# EAGLE schematic FPGA_S6 (EAGLE 9.6.2)

## Sheet 1 of 3: Interface
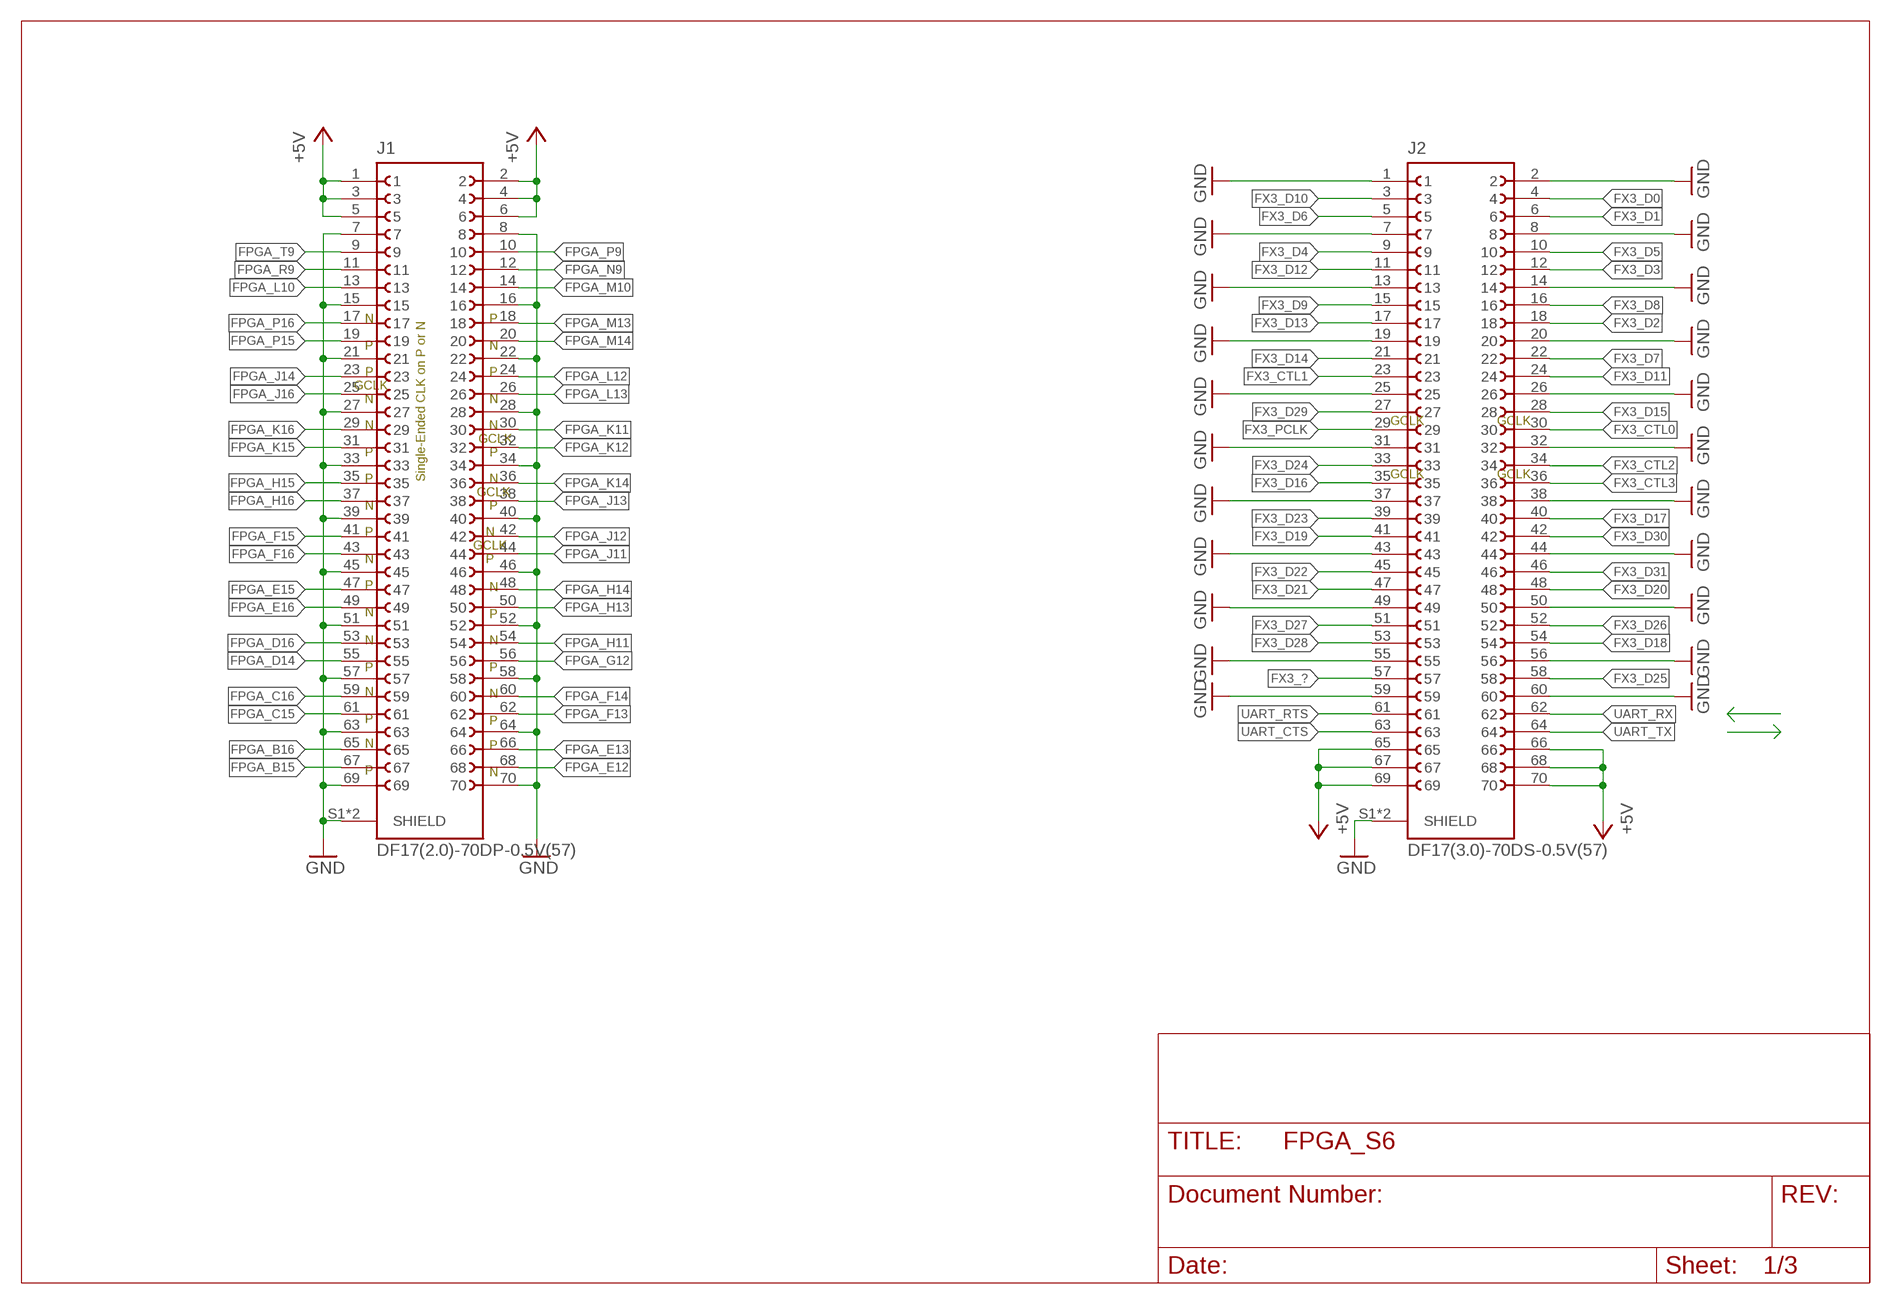
[diagram p0: schematic, sheet 1]

### Parts
J1  DF17(2.0)-70DP-0.5V(57)  [DF17(2.0)-70DP-0.5V(57)]
J2  DF17(3.0)-70DS-0.5V(57)  [DF17(3.0)-70DS-0.5V(57)]

### Nets
+5V: J1.1 J1.2 J1.3 J1.4 J1.5 J1.6 J2.65 J2.66 J2.67 J2.68 J2.69 J2.70 ; also sheet 3
FPGA_B15 [data]: J1.67 ; also sheet 2
FPGA_B16 [data]: J1.65 ; also sheet 2
FPGA_C15 [data]: J1.61 ; also sheet 2
FPGA_C16 [data]: J1.59 ; also sheet 2
FPGA_D14 [data]: J1.55 ; also sheet 2
FPGA_D16 [data]: J1.53 ; also sheet 2
FPGA_E12 [data]: J1.68 ; also sheet 2
FPGA_E13 [data]: J1.66 ; also sheet 2
FPGA_E15 [data]: J1.47 ; also sheet 2
FPGA_E16 [data]: J1.49 ; also sheet 2
FPGA_F13 [data]: J1.62 ; also sheet 2
FPGA_F14 [data]: J1.60 ; also sheet 2
FPGA_F15 [data]: J1.41 ; also sheet 2
FPGA_F16 [data]: J1.43 ; also sheet 2
FPGA_G12 [data]: J1.56 ; also sheet 2
FPGA_H11 [data]: J1.54 ; also sheet 2
FPGA_H13 [data]: J1.50 ; also sheet 2
FPGA_H14 [data]: J1.48 ; also sheet 2
FPGA_H15 [data]: J1.35 ; also sheet 2
FPGA_H16 [data]: J1.37 ; also sheet 2
FPGA_J11 [data]: J1.44 ; also sheet 2
FPGA_J12 [data]: J1.42 ; also sheet 2
FPGA_J13 [data]: J1.38 ; also sheet 2
FPGA_J14 [data]: J1.23 ; also sheet 2
FPGA_J16 [data]: J1.25 ; also sheet 2
FPGA_K11 [data]: J1.30 ; also sheet 2
FPGA_K12 [data]: J1.32 ; also sheet 2
FPGA_K14 [data]: J1.36 ; also sheet 2
FPGA_K15 [data]: J1.31 ; also sheet 2
FPGA_K16 [data]: J1.29 ; also sheet 2
FPGA_L10 [data]: J1.13 ; also sheet 2
FPGA_L12 [data]: J1.24 ; also sheet 2
FPGA_L13 [data]: J1.26 ; also sheet 2
FPGA_M10 [data]: J1.14 ; also sheet 2
FPGA_M13 [data]: J1.18 ; also sheet 2
FPGA_M14 [data]: J1.20 ; also sheet 2
FPGA_N9 [data]: J1.12 ; also sheet 2
FPGA_P9 [data]: J1.10 ; also sheet 2
FPGA_P15 [data]: J1.19 ; also sheet 2
FPGA_P16 [data]: J1.17 ; also sheet 2
FPGA_R9 [data]: J1.11 ; also sheet 2
FPGA_T9 [data]: J1.9 ; also sheet 2
FX3_? [data]: J2.57 ; also sheet 2
FX3_CTL0 [data]: J2.30 ; also sheet 2
FX3_CTL1 [data]: J2.23 ; also sheet 2
FX3_CTL2 [data]: J2.34 ; also sheet 2
FX3_CTL3 [data]: J2.36 ; also sheet 2
FX3_D0 [data]: J2.4 ; also sheet 2
FX3_D1 [data]: J2.6 ; also sheet 2
FX3_D2 [data]: J2.18 ; also sheet 2
FX3_D3 [data]: J2.12 ; also sheet 2
FX3_D4 [data]: J2.9 ; also sheet 2
FX3_D5 [data]: J2.10 ; also sheet 2
FX3_D6 [data]: J2.5 ; also sheet 2
FX3_D7 [data]: J2.22 ; also sheet 2
FX3_D8 [data]: J2.16 ; also sheet 2
FX3_D9 [data]: J2.15 ; also sheet 2
FX3_D10 [data]: J2.3 ; also sheet 2
FX3_D11 [data]: J2.24 ; also sheet 2
FX3_D12 [data]: J2.11 ; also sheet 2
FX3_D13 [data]: J2.17 ; also sheet 2
FX3_D14 [data]: J2.21 ; also sheet 2
FX3_D15 [data]: J2.28 ; also sheet 2
FX3_D16 [data]: J2.35 ; also sheet 2
FX3_D17 [data]: J2.40 ; also sheet 2
FX3_D18 [data]: J2.54 ; also sheet 2
FX3_D19 [data]: J2.41 ; also sheet 2
FX3_D20 [data]: J2.48 ; also sheet 2
FX3_D21 [data]: J2.47 ; also sheet 2
FX3_D22 [data]: J2.45 ; also sheet 2
FX3_D23 [data]: J2.39 ; also sheet 2
FX3_D24 [data]: J2.33 ; also sheet 2
FX3_D25 [data]: J2.58 ; also sheet 2
FX3_D26 [data]: J2.52 ; also sheet 2
FX3_D27 [data]: J2.51 ; also sheet 2
FX3_D28 [data]: J2.53 ; also sheet 2
FX3_D29 [data]: J2.27 ; also sheet 2
FX3_D30 [data]: J2.42 ; also sheet 2
FX3_D31 [data]: J2.46 ; also sheet 2
FX3_PCLK [data]: J2.29 ; also sheet 2
GND: J1.7 J1.8 J1.15 J1.16 J1.21 J1.22 J1.27 J1.28 J1.33 J1.34 J1.39 J1.40 J1.45 J1.46 J1.51 J1.52 J1.57 J1.58 J1.63 J1.64 J1.69 J1.70 J1.S1(SHIELD) J1.S2(SHIELD) J2.1 J2.2 J2.7 J2.8 J2.13 J2.14 J2.19 J2.20 J2.25 J2.26 J2.31 J2.32 J2.37 J2.38 J2.43 J2.44 J2.49 J2.50 J2.55 J2.56 J2.59 J2.60 J2.S1(SHIELD) J2.S2(SHIELD) ; also sheet 2,3
UART_CTS [data]: J2.63 ; also sheet 2
UART_RTS [data]: J2.61 ; also sheet 2
UART_RX [data]: J2.62 ; also sheet 2
UART_TX [data]: J2.64 ; also sheet 2

### Notes on the sheet
- N
   
  P
- P
   
  N
- P
   GCLK
  N
- P
   
  N
- Single-Ended CLK on P or N
- GCLK | GCLK
- N
   
  P
- N
   GCLK
  P
- GCLK | GCLK
- P
   
  N
- N
  GCLK
  P
- P
  
  N
- N
  GCLK
  P
- P
   
  N
- N
   
  P
- N
   
  P
- N
   
  P
- N
   
  P
- N
   
  P
- N
   
  P
- P
   
  N

## Sheet 2 of 3: FPGA
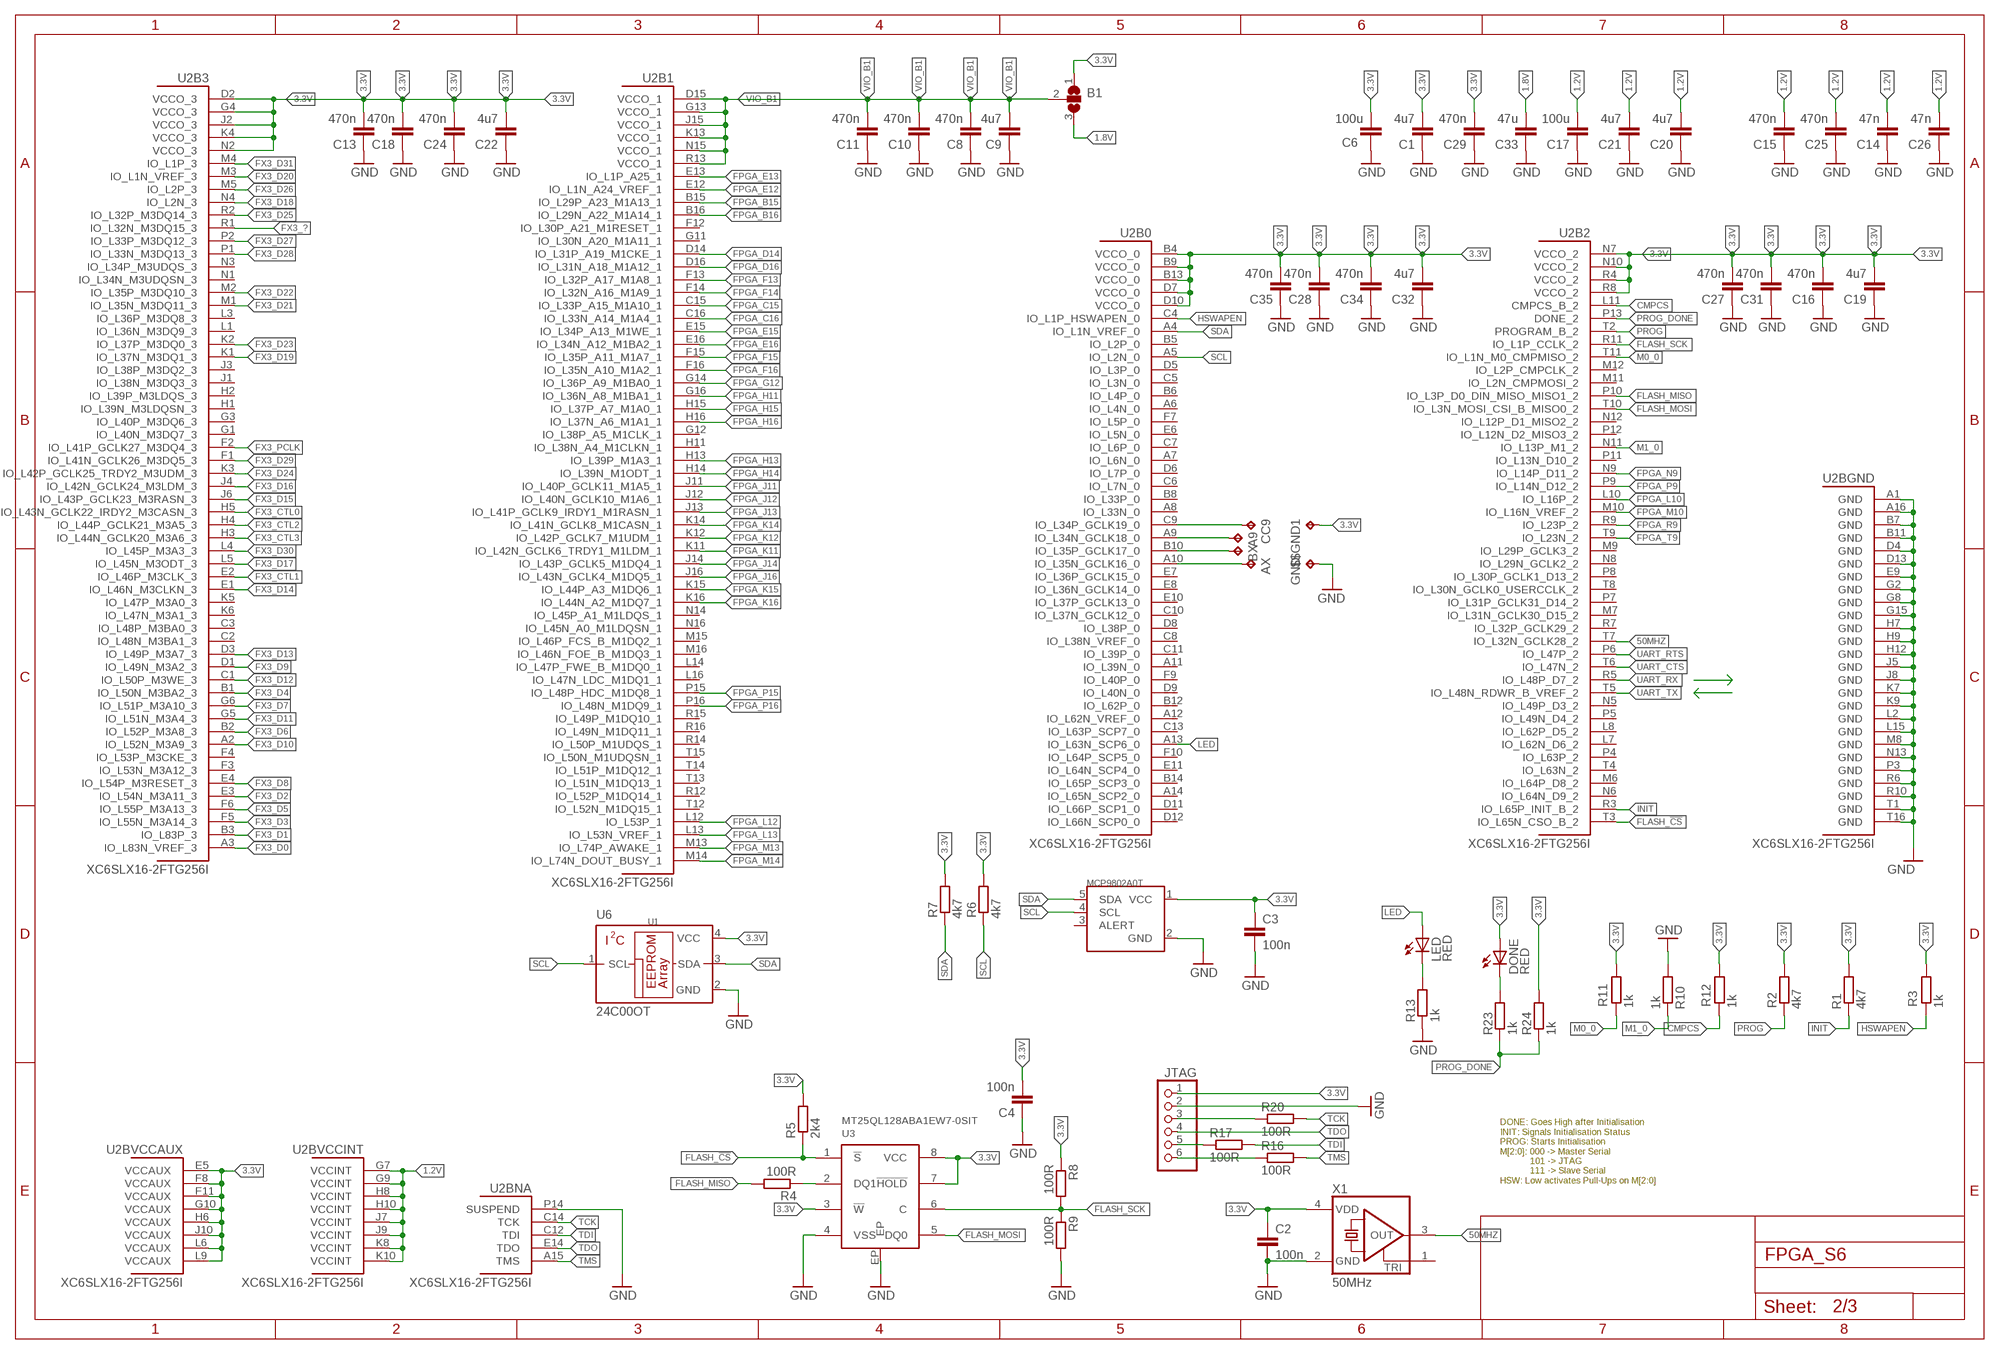
[diagram p1: schematic, sheet 2]

### Parts
$$GND1  TPTP15R  [TP15R]
A9  TPTP15R  [TP15R]
AX  TPTP15R  [TP15R]
B1  SJ2W  [SJ_2]
BX  TPTP15R  [TP15R]
C1  4u7  C-EUC0603  [C0603]
C2  100n  C-EUC0402  [C0402]
C3  100n  C-EUC0402  [C0402]
C4  100n  C-EUC0402  [C0402]
C6  100u  C-EUC1206  [C1206]
C8  470n  C-EUC0402  [C0402]
C9  4u7  C-EUC0603  [C0603]
C10  470n  C-EUC0402  [C0402]
C11  470n  C-EUC0402  [C0402]
C13  470n  C-EUC0402  [C0402]
C14  47n  C-EUC0402  [C0402]
C15  470n  C-EUC0402  [C0402]
C16  470n  C-EUC0402  [C0402]
C17  100u  C-EUC1206  [C1206]
C18  470n  C-EUC0402  [C0402]
C19  4u7  C-EUC0603  [C0603]
C20  4u7  C-EUC0603  [C0603]
C21  4u7  C-EUC0603  [C0603]
C22  4u7  C-EUC0603  [C0603]
C24  470n  C-EUC0402  [C0402]
C25  470n  C-EUC0402  [C0402]
C26  47n  C-EUC0402  [C0402]
C27  470n  C-EUC0402  [C0402]
C28  470n  C-EUC0402  [C0402]
C29  470n  C-EUC0402  [C0402]
C31  470n  C-EUC0402  [C0402]
C32  4u7  C-EUC0603  [C0603]
C33  47u  C-EUC0805  [C0805]
C34  470n  C-EUC0402  [C0402]
C35  470n  C-EUC0402  [C0402]
CC9  TPTP15R  [TP15R]
DONE  RED  LEDCHIP-LED0603  [CHIP-LED0603]
GND  TPTP15R  [TP15R]
JTAG  PINHD-1X6_2.00  [1X06M]
LED  RED  LEDCHIP-LED0603  [CHIP-LED0603]
R1  4k7  R-EU_R0402  [R0402]
R2  4k7  R-EU_R0402  [R0402]
R3  1k  R-EU_R0402  [R0402]
R4  100R  R-EU_R0402  [R0402]
R5  2k4  R-EU_R0402  [R0402]
R6  4k7  R-EU_R0402  [R0402]
R7  4k7  R-EU_R0402  [R0402]
R8  100R  R-EU_R0402  [R0402]
R9  100R  R-EU_R0402  [R0402]
R10  1k  R-EU_R0402  [R0402]
R11  1k  R-EU_R0402  [R0402]
R12  1k  R-EU_R0402  [R0402]
R13  1k  R-EU_R0402  [R0402]
R16  100R  R-EU_R0402  [R0402]
R17  100R  R-EU_R0402  [R0402]
R20  100R  R-EU_R0402  [R0402]
R23  1k  R-EU_R0402  [R0402]
R24  1k  R-EU_R0402  [R0402]
U1  MCP9802A0T  [SOT23-5L]
U2  XC6SLX16-2FTG256I  6SLX16FTG256  [FT256]
U3  MT25QL128ABA1EW7-0SIT  MT25Q  [MT25QL128ABA1EW7-0SIT]
U6  24C00OT  [SOT23-5L]
X1  50MHz  ASE  [ASE]

### Nets
1.2V: C14.2 C15.2 C17.1 C20.2 C21.2 C25.2 C26.2 U2.G7(BVCCINT:VCCINT) U2.G9(BVCCINT:VCCINT) U2.H8(BVCCINT:VCCINT) U2.H10(BVCCINT:VCCINT) U2.J7(BVCCINT:VCCINT) U2.J9(BVCCINT:VCCINT) U2.K8(BVCCINT:VCCINT) U2.K10(BVCCINT:VCCINT) ; also sheet 3
1.8V: B1.3 C33.2 ; also sheet 3
3.3V: $$GND1.TP B1.1 C1.2 C2.1 C3.1 C4.2 C6.1 C13.2 C16.2 C18.2 C19.2 C22.2 C24.2 C27.2 C28.2 C29.2 C31.2 C32.2 C34.2 C35.2 DONE.A JTAG.1 R1.2 R2.1 R3.1 R5.2 R6.1 R7.1 R8.1 R11.1 R12.1 R24.2 U1.1(VCC) U2.B4(B0:VCCO_0) U2.B9(B0:VCCO_0) U2.B13(B0:VCCO_0) U2.D2(B3:VCCO_3) U2.D7(B0:VCCO_0) U2.D10(B0:VCCO_0) U2.E5(BVCCAUX:VCCAUX) U2.F8(BVCCAUX:VCCAUX) U2.F11(BVCCAUX:VCCAUX) U2.G4(B3:VCCO_3) U2.G10(BVCCAUX:VCCAUX) U2.H6(BVCCAUX:VCCAUX) U2.J2(B3:VCCO_3) U2.J10(BVCCAUX:VCCAUX) U2.K4(B3:VCCO_3) U2.L6(BVCCAUX:VCCAUX) U2.L9(BVCCAUX:VCCAUX) U2.N2(B3:VCCO_3) U2.N7(B2:VCCO_2) U2.N10(B2:VCCO_2) U2.R4(B2:VCCO_2) U2.R8(B2:VCCO_2) U3.3(!W) U3.7(!HOLD) U3.8(VCC) U6.4(VCC) X1.4(VDD) ; also sheet 3
50MHZ: U2.T7(B2:IO_L32N_GCLK28_2) X1.3(OUT)
CMPCS: R12.2 U2.L11(B2:CMPCS_B_2)
FLASH_!CS: R5.1 U2.T3(B2:IO_L65N_CSO_B_2) U3.1(!S)
FLASH_MISO: R4.2 U2.P10(B2:IO_L3P_D0_DIN_MISO_MISO1_2)
FLASH_MOSI: U2.T10(B2:IO_L3N_MOSI_CSI_B_MISO0_2) U3.5(DQ0)
FLASH_SCK: R8.2 R9.1 U2.R11(B2:IO_L1P_CCLK_2) U3.6(C)
FPGA_B15 [data]: U2.B15(B1:IO_L29P_A23_M1A13_1) ; also sheet 1
FPGA_B16 [data]: U2.B16(B1:IO_L29N_A22_M1A14_1) ; also sheet 1
FPGA_C15 [data]: U2.C15(B1:IO_L33P_A15_M1A10_1) ; also sheet 1
FPGA_C16 [data]: U2.C16(B1:IO_L33N_A14_M1A4_1) ; also sheet 1
FPGA_D14 [data]: U2.D14(B1:IO_L31P_A19_M1CKE_1) ; also sheet 1
FPGA_D16 [data]: U2.D16(B1:IO_L31N_A18_M1A12_1) ; also sheet 1
FPGA_E12 [data]: U2.E12(B1:IO_L1N_A24_VREF_1) ; also sheet 1
FPGA_E13 [data]: U2.E13(B1:IO_L1P_A25_1) ; also sheet 1
FPGA_E15 [data]: U2.E15(B1:IO_L34P_A13_M1WE_1) ; also sheet 1
FPGA_E16 [data]: U2.E16(B1:IO_L34N_A12_M1BA2_1) ; also sheet 1
FPGA_F13 [data]: U2.F13(B1:IO_L32P_A17_M1A8_1) ; also sheet 1
FPGA_F14 [data]: U2.F14(B1:IO_L32N_A16_M1A9_1) ; also sheet 1
FPGA_F15 [data]: U2.F15(B1:IO_L35P_A11_M1A7_1) ; also sheet 1
FPGA_F16 [data]: U2.F16(B1:IO_L35N_A10_M1A2_1) ; also sheet 1
FPGA_G12 [data]: U2.G14(B1:IO_L36P_A9_M1BA0_1) ; also sheet 1
FPGA_H11 [data]: U2.G16(B1:IO_L36N_A8_M1BA1_1) ; also sheet 1
FPGA_H13 [data]: U2.H13(B1:IO_L39P_M1A3_1) ; also sheet 1
FPGA_H14 [data]: U2.H14(B1:IO_L39N_M1ODT_1) ; also sheet 1
FPGA_H15 [data]: U2.H15(B1:IO_L37P_A7_M1A0_1) ; also sheet 1
FPGA_H16 [data]: U2.H16(B1:IO_L37N_A6_M1A1_1) ; also sheet 1
FPGA_J11 [data]: U2.J11(B1:IO_L40P_GCLK11_M1A5_1) ; also sheet 1
FPGA_J12 [data]: U2.J12(B1:IO_L40N_GCLK10_M1A6_1) ; also sheet 1
FPGA_J13 [data]: U2.J13(B1:IO_L41P_GCLK9_IRDY1_M1RASN_1) ; also sheet 1
FPGA_J14 [data]: U2.J14(B1:IO_L43P_GCLK5_M1DQ4_1) ; also sheet 1
FPGA_J16 [data]: U2.J16(B1:IO_L43N_GCLK4_M1DQ5_1) ; also sheet 1
FPGA_K11 [data]: U2.K11(B1:IO_L42N_GCLK6_TRDY1_M1LDM_1) ; also sheet 1
FPGA_K12 [data]: U2.K12(B1:IO_L42P_GCLK7_M1UDM_1) ; also sheet 1
FPGA_K14 [data]: U2.K14(B1:IO_L41N_GCLK8_M1CASN_1) ; also sheet 1
FPGA_K15 [data]: U2.K15(B1:IO_L44P_A3_M1DQ6_1) ; also sheet 1
FPGA_K16 [data]: U2.K16(B1:IO_L44N_A2_M1DQ7_1) ; also sheet 1
FPGA_L10 [data]: U2.L10(B2:IO_L16P_2) ; also sheet 1
FPGA_L12 [data]: U2.L12(B1:IO_L53P_1) ; also sheet 1
FPGA_L13 [data]: U2.L13(B1:IO_L53N_VREF_1) ; also sheet 1
FPGA_M10 [data]: U2.M10(B2:IO_L16N_VREF_2) ; also sheet 1
FPGA_M13 [data]: U2.M13(B1:IO_L74P_AWAKE_1) ; also sheet 1
FPGA_M14 [data]: U2.M14(B1:IO_L74N_DOUT_BUSY_1) ; also sheet 1
FPGA_N9 [data]: U2.N9(B2:IO_L14P_D11_2) ; also sheet 1
FPGA_P9 [data]: U2.P9(B2:IO_L14N_D12_2) ; also sheet 1
FPGA_P15 [data]: U2.P15(B1:IO_L48P_HDC_M1DQ8_1) ; also sheet 1
FPGA_P16 [data]: U2.P16(B1:IO_L48N_M1DQ9_1) ; also sheet 1
FPGA_R9 [data]: U2.R9(B2:IO_L23P_2) ; also sheet 1
FPGA_T9 [data]: U2.T9(B2:IO_L23N_2) ; also sheet 1
FX3_? [data]: U2.R1(B3:IO_L32N_M3DQ15_3) ; also sheet 1
FX3_CTL0 [data]: U2.H5(B3:IO_L43N_GCLK22_IRDY2_M3CASN_3) ; also sheet 1
FX3_CTL1 [data]: U2.E2(B3:IO_L46P_M3CLK_3) ; also sheet 1
FX3_CTL2 [data]: U2.H4(B3:IO_L44P_GCLK21_M3A5_3) ; also sheet 1
FX3_CTL3 [data]: U2.H3(B3:IO_L44N_GCLK20_M3A6_3) ; also sheet 1
FX3_D0 [data]: U2.A3(B3:IO_L83N_VREF_3) ; also sheet 1
FX3_D1 [data]: U2.B3(B3:IO_L83P_3) ; also sheet 1
FX3_D2 [data]: U2.E3(B3:IO_L54N_M3A11_3) ; also sheet 1
FX3_D3 [data]: U2.F5(B3:IO_L55N_M3A14_3) ; also sheet 1
FX3_D4 [data]: U2.B1(B3:IO_L50N_M3BA2_3) ; also sheet 1
FX3_D5 [data]: U2.F6(B3:IO_L55P_M3A13_3) ; also sheet 1
FX3_D6 [data]: U2.B2(B3:IO_L52P_M3A8_3) ; also sheet 1
FX3_D7 [data]: U2.G6(B3:IO_L51P_M3A10_3) ; also sheet 1
FX3_D8 [data]: U2.E4(B3:IO_L54P_M3RESET_3) ; also sheet 1
FX3_D9 [data]: U2.D1(B3:IO_L49N_M3A2_3) ; also sheet 1
FX3_D10 [data]: U2.A2(B3:IO_L52N_M3A9_3) ; also sheet 1
FX3_D11 [data]: U2.G5(B3:IO_L51N_M3A4_3) ; also sheet 1
FX3_D12 [data]: U2.C1(B3:IO_L50P_M3WE_3) ; also sheet 1
FX3_D13 [data]: U2.D3(B3:IO_L49P_M3A7_3) ; also sheet 1
FX3_D14 [data]: U2.E1(B3:IO_L46N_M3CLKN_3) ; also sheet 1
FX3_D15 [data]: U2.J6(B3:IO_L43P_GCLK23_M3RASN_3) ; also sheet 1
FX3_D16 [data]: U2.J4(B3:IO_L42N_GCLK24_M3LDM_3) ; also sheet 1
FX3_D17 [data]: U2.L5(B3:IO_L45N_M3ODT_3) ; also sheet 1
FX3_D18 [data]: U2.N4(B3:IO_L2N_3) ; also sheet 1
FX3_D19 [data]: U2.K1(B3:IO_L37N_M3DQ1_3) ; also sheet 1
FX3_D20 [data]: U2.M3(B3:IO_L1N_VREF_3) ; also sheet 1
FX3_D21 [data]: U2.M1(B3:IO_L35N_M3DQ11_3) ; also sheet 1
FX3_D22 [data]: U2.M2(B3:IO_L35P_M3DQ10_3) ; also sheet 1
FX3_D23 [data]: U2.K2(B3:IO_L37P_M3DQ0_3) ; also sheet 1
FX3_D24 [data]: U2.K3(B3:IO_L42P_GCLK25_TRDY2_M3UDM_3) ; also sheet 1
FX3_D25 [data]: U2.R2(B3:IO_L32P_M3DQ14_3) ; also sheet 1
FX3_D26 [data]: U2.M5(B3:IO_L2P_3) ; also sheet 1
FX3_D27 [data]: U2.P2(B3:IO_L33P_M3DQ12_3) ; also sheet 1
FX3_D28 [data]: U2.P1(B3:IO_L33N_M3DQ13_3) ; also sheet 1
FX3_D29 [data]: U2.F1(B3:IO_L41N_GCLK26_M3DQ5_3) ; also sheet 1
FX3_D30 [data]: U2.L4(B3:IO_L45P_M3A3_3) ; also sheet 1
FX3_D31 [data]: U2.M4(B3:IO_L1P_3) ; also sheet 1
FX3_PCLK [data]: U2.F2(B3:IO_L41P_GCLK27_M3DQ4_3) ; also sheet 1
GND: C1.1 C2.2 C3.2 C4.1 C6.2 C8.1 C9.1 C10.1 C11.1 C13.1 C14.1 C15.1 C16.1 C17.2 C18.1 C19.1 C20.1 C21.1 C22.1 C24.1 C25.1 C26.1 C27.1 C28.1 C29.1 C31.1 C32.1 C33.1 C34.1 C35.1 GND.TP JTAG.2 R9.2 R10.2 R13.1 U1.2(GND) U2.A1(BGND:GND) U2.A16(BGND:GND) U2.B7(BGND:GND) U2.B11(BGND:GND) U2.D4(BGND:GND) U2.D13(BGND:GND) U2.E9(BGND:GND) U2.G2(BGND:GND) U2.G8(BGND:GND) U2.G15(BGND:GND) U2.H7(BGND:GND) U2.H9(BGND:GND) U2.H12(BGND:GND) U2.J5(BGND:GND) U2.J8(BGND:GND) U2.K7(BGND:GND) U2.K9(BGND:GND) U2.L2(BGND:GND) U2.L15(BGND:GND) U2.M8(BGND:GND) U2.N13(BGND:GND) U2.P3(BGND:GND) U2.P14(BNA:SUSPEND) U2.R6(BGND:GND) U2.R10(BGND:GND) U2.T1(BGND:GND) U2.T16(BGND:GND) U3.4(VSS) U3.EP U6.2(GND) X1.2(GND) ; also sheet 1,3
HSWAPEN: R3.2 U2.C4(B0:IO_L1P_HSWAPEN_0)
INIT: R1.1 U2.R3(B2:IO_L65P_INIT_B_2)
LED: LED.A U2.A13(B0:IO_L63N_SCP6_0)
M0_0: R11.2 U2.T11(B2:IO_L1N_M0_CMPMISO_2)
M1_0: R10.1 U2.N11(B2:IO_L13P_M1_2)
N$00003: BX.TP U2.B10(B0:IO_L35P_GCLK17_0)
N$00004: LED.C R13.2
N$00006: R4.1 U3.2(DQ1)
N$00009: AX.TP U2.A10(B0:IO_L35N_GCLK16_0)
N$00010: A9.TP U2.A9(B0:IO_L34N_GCLK18_0)
N$00011: CC9.TP U2.C9(B0:IO_L34P_GCLK19_0)
N$00019: DONE.C R23.2
N$00022: JTAG.5 R17.1
N$00027: JTAG.3 R20.1
N$00031: JTAG.6 R16.1
PROG: R2.2 U2.T2(B2:PROGRAM_B_2)
PROG_DONE: R23.1 R24.1 U2.P13(B2:DONE_2)
SCL: R6.2 U1.4(SCL) U2.A5(B0:IO_L2N_0) U6.1(SCL)
SDA: R7.2 U1.5(SDA) U2.A4(B0:IO_L1N_VREF_0) U6.3(SDA)
TCK: R20.2 U2.C14(BNA:TCK)
TDI: R17.2 U2.C12(BNA:TDI)
TDO: JTAG.4 U2.E14(BNA:TDO)
TMS: R16.2 U2.A15(BNA:TMS)
UART_CTS [data]: U2.T6(B2:IO_L47N_2) ; also sheet 1
UART_RTS [data]: U2.P6(B2:IO_L47P_2) ; also sheet 1
UART_RX [data]: U2.R5(B2:IO_L48P_D7_2) ; also sheet 1
UART_TX [data]: U2.T5(B2:IO_L48N_RDWR_B_VREF_2) ; also sheet 1
VIO_B1: B1.2 C8.2 C9.2 C10.2 C11.2 U2.D15(B1:VCCO_1) U2.G13(B1:VCCO_1) U2.J15(B1:VCCO_1) U2.K13(B1:VCCO_1) U2.N15(B1:VCCO_1) U2.R13(B1:VCCO_1)
Unconnected: U1.3(ALERT) U2.A6(B0:IO_L4N_0) U2.A7(B0:IO_L6N_0) U2.A8(B0:IO_L33N_0) U2.A11(B0:IO_L39N_0) U2.A12(B0:IO_L62N_VREF_0) U2.A14(B0:IO_L65N_SCP2_0) U2.B5(B0:IO_L2P_0) U2.B6(B0:IO_L4P_0) U2.B8(B0:IO_L33P_0) U2.B12(B0:IO_L62P_0) U2.B14(B0:IO_L65P_SCP3_0) U2.C2(B3:IO_L48N_M3BA1_3) U2.C3(B3:IO_L48P_M3BA0_3) U2.C5(B0:IO_L3N_0) U2.C6(B0:IO_L7N_0) U2.C7(B0:IO_L6P_0) U2.C8(B0:IO_L38N_VREF_0) U2.C10(B0:IO_L37N_GCLK12_0) U2.C11(B0:IO_L39P_0) U2.C13(B0:IO_L63P_SCP7_0) U2.D5(B0:IO_L3P_0) U2.D6(B0:IO_L7P_0) U2.D8(B0:IO_L38P_0) U2.D9(B0:IO_L40N_0) U2.D11(B0:IO_L66P_SCP1_0) U2.D12(B0:IO_L66N_SCP0_0) U2.E6(B0:IO_L5N_0) U2.E7(B0:IO_L36P_GCLK15_0) U2.E8(B0:IO_L36N_GCLK14_0) U2.E10(B0:IO_L37P_GCLK13_0) U2.E11(B0:IO_L64N_SCP4_0) U2.F3(B3:IO_L53N_M3A12_3) U2.F4(B3:IO_L53P_M3CKE_3) U2.F7(B0:IO_L5P_0) U2.F9(B0:IO_L40P_0) U2.F10(B0:IO_L64P_SCP5_0) U2.F12(B1:IO_L30P_A21_M1RESET_1) U2.G1(B3:IO_L40N_M3DQ7_3) U2.G3(B3:IO_L40P_M3DQ6_3) U2.G11(B1:IO_L30N_A20_M1A11_1) U2.G12(B1:IO_L38P_A5_M1CLK_1) U2.H1(B3:IO_L39N_M3LDQSN_3) U2.H2(B3:IO_L39P_M3LDQS_3) U2.H11(B1:IO_L38N_A4_M1CLKN_1) U2.J1(B3:IO_L38N_M3DQ3_3) U2.J3(B3:IO_L38P_M3DQ2_3) U2.K5(B3:IO_L47P_M3A0_3) U2.K6(B3:IO_L47N_M3A1_3) U2.L1(B3:IO_L36N_M3DQ9_3) U2.L3(B3:IO_L36P_M3DQ8_3) U2.L7(B2:IO_L62N_D6_2) U2.L8(B2:IO_L62P_D5_2) U2.L14(B1:IO_L47P_FWE_B_M1DQ0_1) U2.L16(B1:IO_L47N_LDC_M1DQ1_1) U2.M6(B2:IO_L64P_D8_2) U2.M7(B2:IO_L31N_GCLK30_D15_2) U2.M9(B2:IO_L29P_GCLK3_2) U2.M11(B2:IO_L2N_CMPMOSI_2) U2.M12(B2:IO_L2P_CMPCLK_2) U2.M15(B1:IO_L46P_FCS_B_M1DQ2_1) U2.M16(B1:IO_L46N_FOE_B_M1DQ3_1) U2.N1(B3:IO_L34N_M3UDQSN_3) U2.N3(B3:IO_L34P_M3UDQS_3) U2.N5(B2:IO_L49P_D3_2) U2.N6(B2:IO_L64N_D9_2) U2.N8(B2:IO_L29N_GCLK2_2) U2.N12(B2:IO_L12P_D1_MISO2_2) U2.N14(B1:IO_L45P_A1_M1LDQS_1) U2.N16(B1:IO_L45N_A0_M1LDQSN_1) U2.P4(B2:IO_L63P_2) U2.P5(B2:IO_L49N_D4_2) U2.P7(B2:IO_L31P_GCLK31_D14_2) U2.P8(B2:IO_L30P_GCLK1_D13_2) U2.P11(B2:IO_L13N_D10_2) U2.P12(B2:IO_L12N_D2_MISO3_2) U2.R7(B2:IO_L32P_GCLK29_2) U2.R12(B1:IO_L52P_M1DQ14_1) U2.R14(B1:IO_L50P_M1UDQS_1) U2.R15(B1:IO_L49P_M1DQ10_1) U2.R16(B1:IO_L49N_M1DQ11_1) U2.T4(B2:IO_L63N_2) U2.T8(B2:IO_L30N_GCLK0_USERCCLK_2) U2.T12(B1:IO_L52N_M1DQ15_1) U2.T13(B1:IO_L51N_M1DQ13_1) U2.T14(B1:IO_L51P_M1DQ12_1) U2.T15(B1:IO_L50N_M1UDQSN_1) X1.1(TRI)

### Notes on the sheet
- DONE: Goes High after Initialisation
  INIT: Signals Initialisation Status
  PROG: Starts Initialisation
  M[2:0]: 000 -> Master Serial
              101 -> JTAG
              111 -> Slave Serial
  HSW: Low activates Pull-Ups on M[2:0]

## Sheet 3 of 3: Power
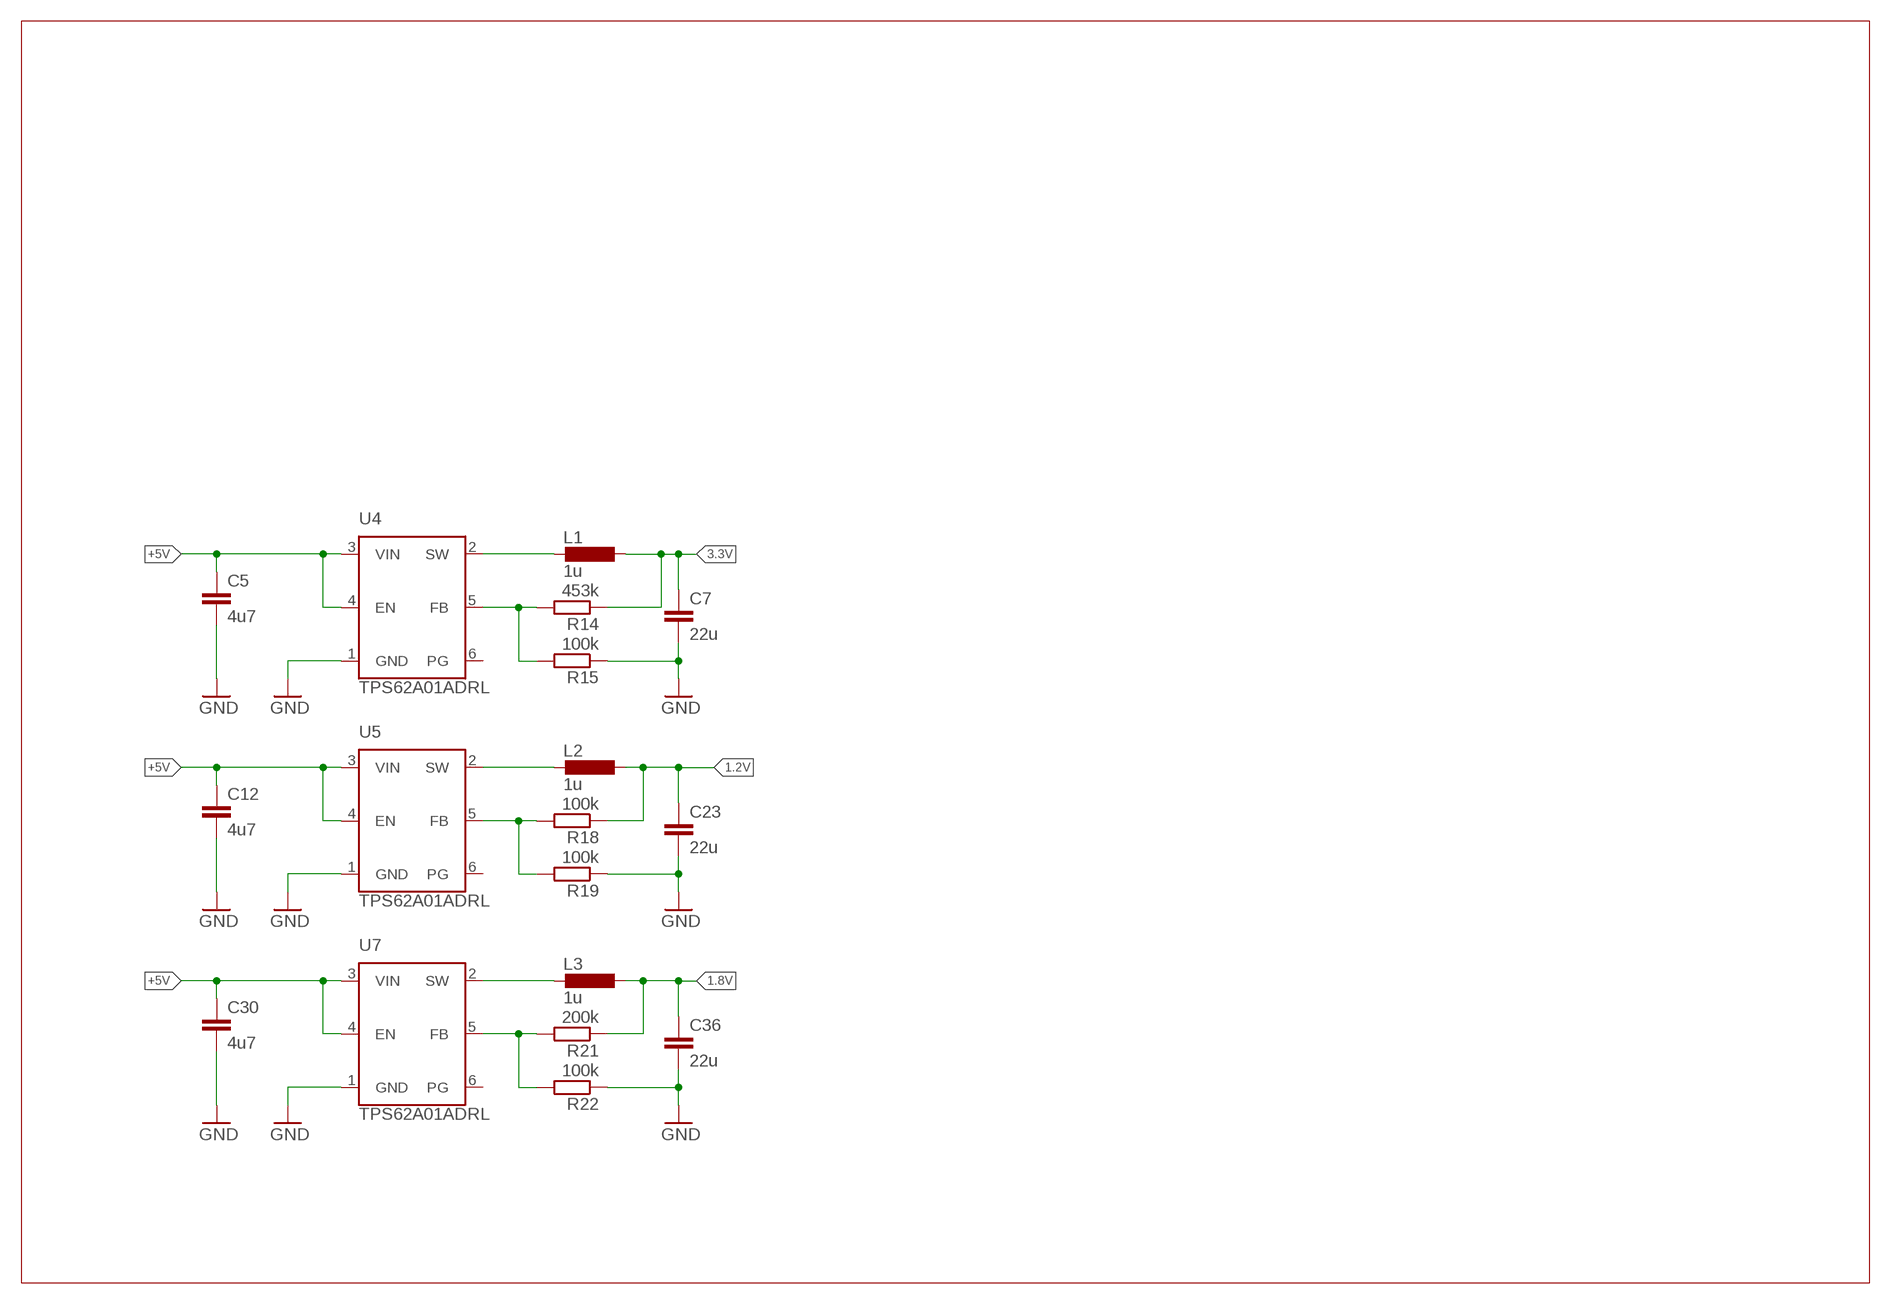
[diagram p2: schematic, sheet 3]

### Parts
C5  4u7  C-EUC0603  [C0603]
C7  22u  C-EUC0603  [C0603]
C12  4u7  C-EUC0603  [C0603]
C23  22u  C-EUC0603  [C0603]
C30  4u7  C-EUC0603  [C0603]
C36  22u  C-EUC0603  [C0603]
L1  1u  L-EU1008  [L1008]
L2  1u  L-EU1008  [L1008]
L3  1u  L-EU1008  [L1008]
R14  453k  R-EU_R0402  [R0402]
R15  100k  R-EU_R0402  [R0402]
R18  100k  R-EU_R0402  [R0402]
R19  100k  R-EU_R0402  [R0402]
R21  200k  R-EU_R0402  [R0402]
R22  100k  R-EU_R0402  [R0402]
U4  TPS62A01ADRL  [SOTFL50P160X60-6N]
U5  TPS62A01ADRL  [SOTFL50P160X60-6N]
U7  TPS62A01ADRL  [SOTFL50P160X60-6N]

### Nets
1.2V: C23.1 L2.1 R18.1 ; also sheet 2
1.8V: C36.1 L3.1 R21.1 ; also sheet 2
3.3V: C7.1 L1.1 R14.1 ; also sheet 2
+5V: C5.1 C12.1 C30.1 U4.3(VIN) U4.4(EN) U5.3(VIN) U5.4(EN) U7.3(VIN) U7.4(EN) ; also sheet 1
GND: C5.2 C7.2 C12.2 C23.2 C30.2 C36.2 R15.1 R19.1 R22.1 U4.1(GND) U5.1(GND) U7.1(GND) ; also sheet 1,2
N$00005: L2.2 U5.2(SW)
N$00040: R18.2 R19.2 U5.5(FB)
N$00044: R14.2 R15.2 U4.5(FB)
N$00045: L3.2 U7.2(SW)
N$00049: R21.2 R22.2 U7.5(FB)
N$50: L1.2 U4.2(SW)
Unconnected: U4.6(PG) U5.6(PG) U7.6(PG)

## Library data of the parts
$$GND1 A9 AX BX CC9 GND = testpad:TP: Test pad
B1 = jumper:SJ2W: SMD solder JUMPER
C1 C5 C9 C12 C19-C22 C30 C32 = rcl:C-EU: CAPACITOR, European symbol; LCSC: C19666
C2-C4 = rcl:C-EU: CAPACITOR, European symbol; LCSC: C1525
C6 C17 = rcl:C-EU: CAPACITOR, European symbol; DIGIKEY: 490-GRM31CD80J107MEA8LCT-ND; LCSC: C15008; SPICEPREFIX: C
C7 C23 C36 = rcl:C-EU: CAPACITOR, European symbol; LCSC: C109448
C8 C10 C11 C13 C15 C16 C18 C24 C25 C27-C29 C31 C34 C35 = rcl:C-EU: CAPACITOR, European symbol; LCSC: C162159
C14 C26 = rcl:C-EU: CAPACITOR, European symbol; LCSC: C327054
C33 = rcl:C-EU: CAPACITOR, European symbol; LCSC: C77072
DONE LED = led:LED: LED OSRAM: - CHIPLED LG R971, LG N971, LY N971, LG Q971, LY Q971, LO R971, LY R971 LH N974, LH R974 LS Q976, LO Q976, LY Q976 LO Q996 - Hyper CHIPLED LW Q18S LB Q993, LB Q99A, LB R99A - SideLED LS A670, LO A670, LY A670, LG A670, LP A670 LB A673, LV A673, LT A673, LW A673 LH A674 LY A675 LS A676, LA A676, LO A676, LY A676, LW A676 LS A679, LY A679, LG A679 - Hyper Micro SIDELED® LS Y876, LA Y876, LO Y876, LY Y876 LT Y87S - SmartLED LW L88C, LW L88S LB L89C, LB L89S, LG L890 LS L89K, LO L89K, LY L89K LS L896, LA L896, LO L896, LY L896 - TOPLED LS T670, LO T670, LY T670, LG T670, LP T670 LSG T670, LSP T670, LSY T670, LOP T670, LYG T670 LG T671, LOG T671, LSG T671 LB T673, LV T673, LT T673, LW T673 LH T674 LS T676, LA T676, LO T676, LY T676, LB T676, LH T676, LSB T676, LW T676 LB T67C, LV T67C, LT T67C, LS T67K, LO T67K, LY T67K, LW E67C LS E67B, LA E67B, LO E67B, LY E67B, LB E67C, LV E67C, LT E67C LW T67C LS T679, LY T679, LG T679 LS T770, LO T770, LY T770, LG T770, LP T770 LB T773, LV T773, LT T773, LW T773 LH T774 LS E675, LA E675, LY E675, LS T675 LS T776, LA T776, LO T776, LY T776, LB T776 LHGB T686 LT T68C, LB T68C - Hyper Mini TOPLED® LB M676 - Mini TOPLED Santana® LG M470 LS M47K, LO M47K, LY M47K Source: http://www.osram.convergy.de LUXEON: - LUMILED® LXK2-PW12-R00, LXK2-PW12-S00, LXK2-PW14-U00, LXK2-PW14-V00 LXK2-PM12-R00, LXK2-PM12-S00, LXK2-PM14-U00 LXK2-PE12-Q00, LXK2-PE12-R00, LXK2-PE12-S00, LXK2-PE14-T00, LXK2-PE14-U00 LXK2-PB12-K00, LXK2-PB12-L00, LXK2-PB12-M00, LXK2-PB14-N00, LXK2-PB14-P00, LXK2-PB14-Q00 LXK2-PR12-L00, LXK2-PR12-M00, LXK2-PR14-Q00, LXK2-PR14-R00 LXK2-PD12-Q00, LXK2-PD12-R00, LXK2-PD12-S00 LXK2-PH12-R00, LXK2-PH12-S00 LXK2-PL12-P00, LXK2-PL12-Q00, LXK2-PL12-R00 Source: www.luxeon.com KINGBRIGHT: KA-3528ASYC Source: www.kingbright.com; LCSC: C7493803
J1 = Hirose:DF17(2.0)-70DP-0.5V(57); DIGIKEY: H11133CT-ND; LCSC: C597892
J2 = Hirose:DF17(3.0)-70DS-0.5V(57); DIGIKEY: H11112CT-ND; LCSC: C3644992
JTAG = pinhead:PINHD-1X6: PIN HEADER
L1-L3 = rcl:L-EU: INDUCTOR, European symbol; DIGIKEY: 490-5112-1-ND; LCSC: C86091; MPN: LQM2HPN1R0MG0L
R1 R2 R6 R7 = rcl:R-EU_: RESISTOR, European symbol; LCSC: C25900
R3 R10-R13 R23 R24 = rcl:R-EU_: RESISTOR, European symbol; LCSC: C11702
R4 R8 R9 R16 R17 R20 = rcl:R-EU_: RESISTOR, European symbol; LCSC: C25076
R5 = rcl:R-EU_: RESISTOR, European symbol; BUERKLIN: 07E632; LAGERORT: 65/04; MBM: 10; PREIS: 0,03867
R14 = rcl:R-EU_: RESISTOR, European symbol; LCSC: C137978; SPICEPREFIX: R
R15 = rcl:R-EU_: RESISTOR, European symbol; DIGIKEY: RMCF0402FT100KCT-ND; LCSC: C60491; SPICEPREFIX: R
R18 = rcl:R-EU_: RESISTOR, European symbol; DIGIKEY: RMCF0402FT66K5CT-ND; LCSC: C2998095; SPICEPREFIX: R
R19 R22 = rcl:R-EU_: RESISTOR, European symbol; LCSC: C60491; SPICEPREFIX: R
R21 = rcl:R-EU_: RESISTOR, European symbol; LCSC: C114763; SPICEPREFIX: R
U1 = microchip:MCP9802A0T: MCP980/1/2/3 2-Wire High-Accuracy Temperature Sensor; FARNELL: 1439487; MBM: 1; PREIS: 1.18
U2 = xilinx:6SLX16FTG256: Xilinx FPGA: 6SLX16FTG256; DIGIKEY: 122-1752-ND; MBM: 1; PREIS: 29,4
U3 = mh_fpga_anschlussplatine_v2:MT25Q: MT25QL128ABA1EW7-0SIT IC FLASH 128MBIT 133MHZ 8WPDFN; DIGIKEY: 557-1790-ND; LAGERORT: 128/05; MBM: 1; PREIS: 1,8
U4 U5 U7 = TPS62A01DRLR:TPS62A01ADRL; DESCRIPTION: 2.5V-5.5V input, 1-A high efficiency step-down converter in 2x2 QFN or SOT563 package; DIGIKEY: 296-TPS62A01ADRLRCT-ND; HEIGHT: 0.6mm; LCSC: C5181455; MANUFACTURER_NAME: Texas Instruments; MANUFACTURER_PART_NUMBER: TPS62A01ADRLR; MOUSER: 595-TPS62A01ADRLR
U6 = microchip:24*00: Serial EEPROM 128 bit, I2C (AA = 1.8 V/LC = 2.5 V/C = 5.0 V); MF: MICROCHIP; MPN: 24C00T-I/OT; OC_FARNELL: 1818713; OC_NEWARK: 92C6937
X1 = crystal:ASE: 3.3Vdc CMOS SMD CRYSTAL CLOCK OSCILLATOR SOurce: www.abracon.com; FARNELL: 2467898; LCSC: C596955; MBM: 1; MPN_: ASE-50.000MHZ-E-T; OC_FARNELL: unknown; OC_NEWARK: unknown; PREIS: 1,54

## Net classes
0 default: width 0.14 mm, drill 0.3 mm